# EAGLE design c64switchless (EAGLE 6.0)
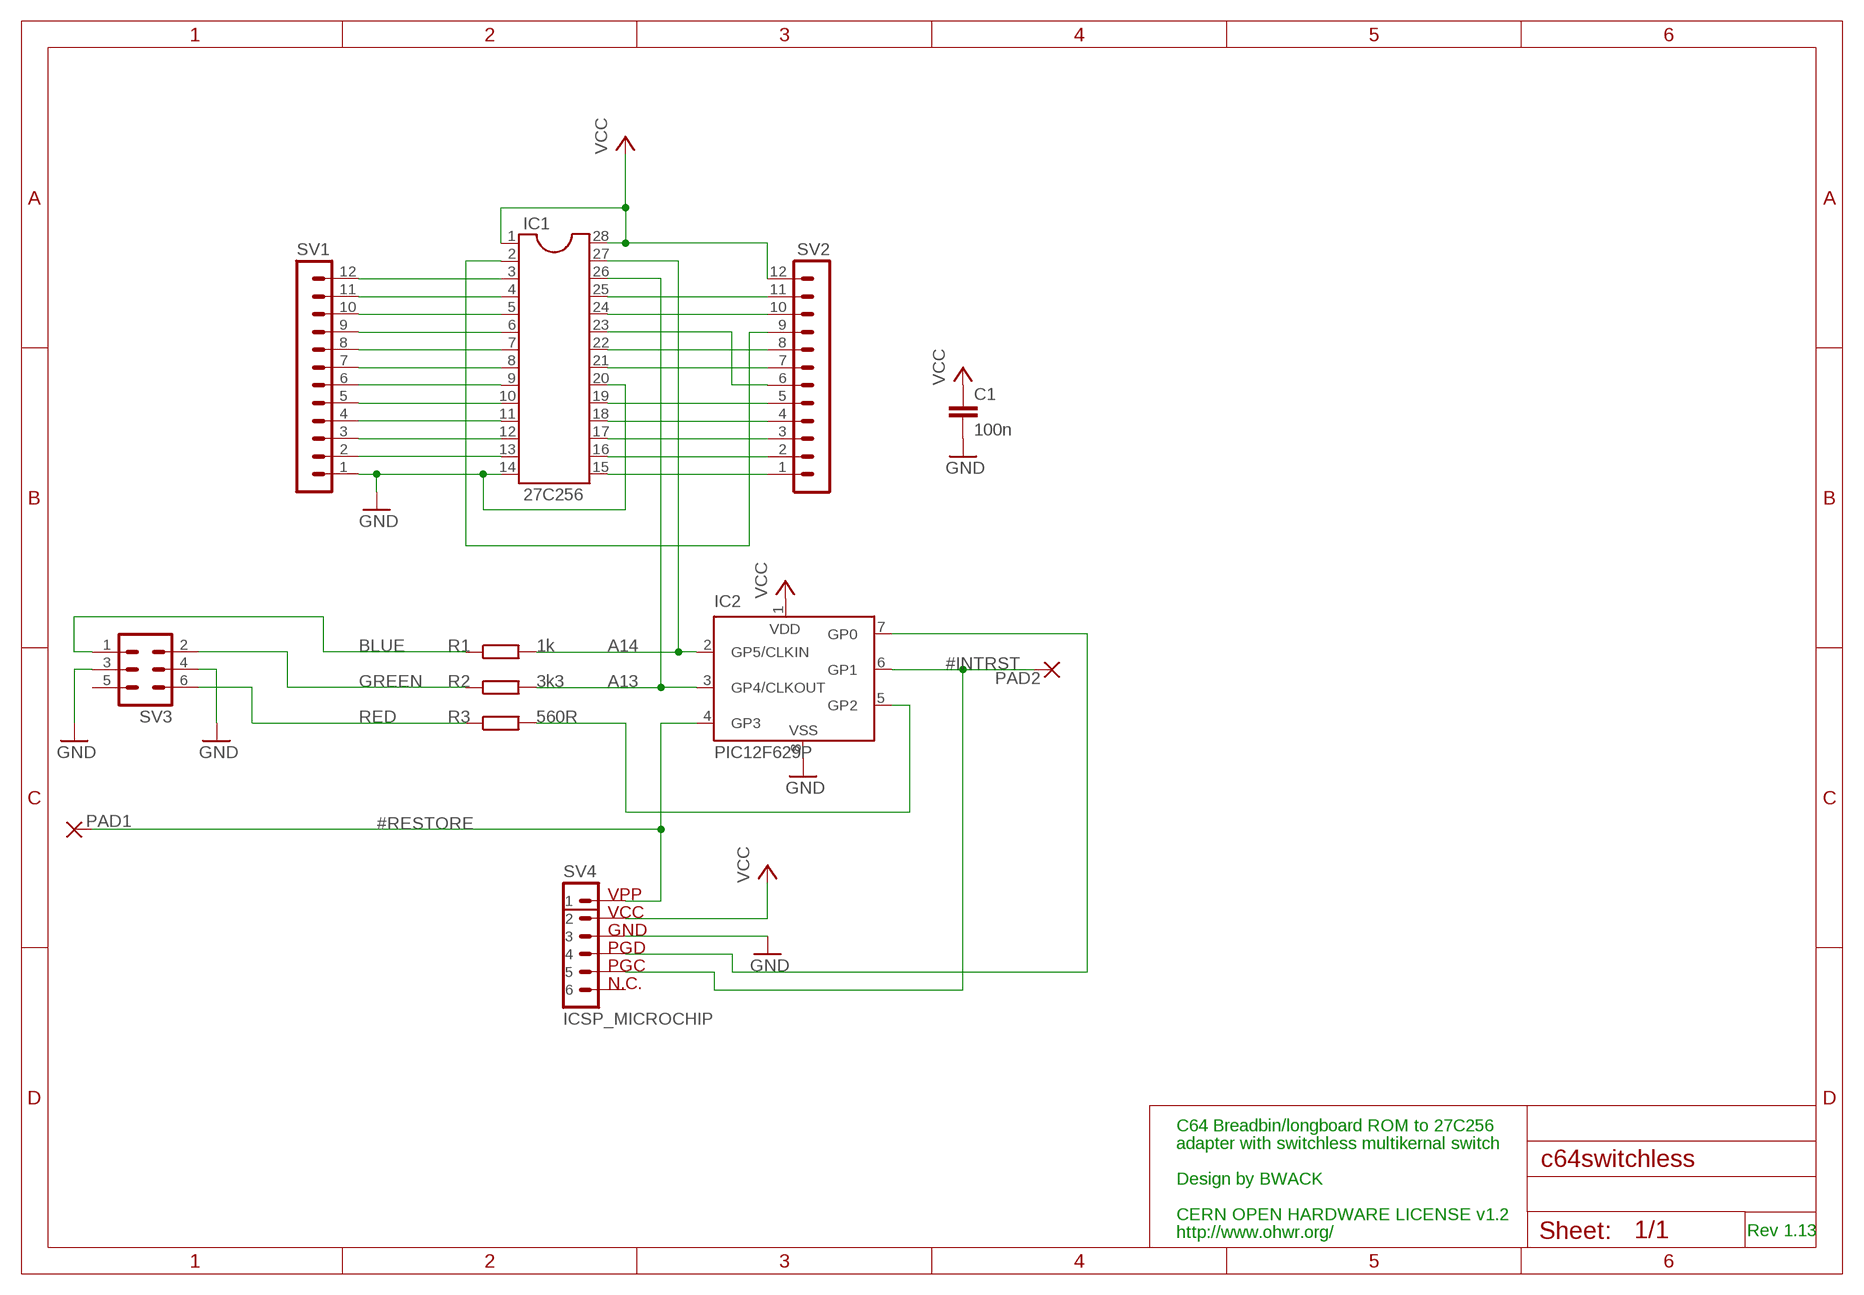
[diagram p0: schematic, sheet 1]

## Parts
C1  100n  C-EU025-024X044  [C025-024X044]
IC1  27C256  DIL28ROUND  [DIL28SPECIAL]
IC2  PIC12F629P  [DIL8]
PAD1  WIREPAD1,6/0,9  [1,6/0,9]
PAD2  WIREPAD1,6/0,9  [1,6/0,9]
R1  1k  R-EU_0207/10  [0207/10]
R2  3k3  R-EU_0207/10  [0207/10]
R3  560R  R-EU_0207/10  [0207/10]
SV1  MA12-1ROUND  [MA12-1ROUND]
SV2  MA12-1ROUND  [MA12-1ROUND]
SV3  MA03-2  [MA03-2]
SV4  ICSP_MICROCHIP  [ICSP_MICROCHIP]

## Nets
#INTRST: IC2.6(GP1) PAD2.1(P) SV4.5
#RESTORE: IC2.4(GP3) PAD1.1(P) SV4.1
A13: IC1.26 IC2.3(GP4/CLKOUT) R2.2
A14: IC1.27 IC2.2(GP5/CLKIN) R1.2
BLUE: R1.1 SV3.1
GND: C1.2 IC1.14 IC1.20 IC2.8(VSS) SV1.1 SV3.3 SV3.4 SV4.3
GREEN: R2.1 SV3.2
N$1: IC2.7(GP0) SV4.4
N$2: IC1.13 SV1.2
N$3: IC1.12 SV1.3
N$4: IC1.11 SV1.4
N$5: IC1.10 SV1.5
N$6: IC1.9 SV1.6
N$7: IC1.8 SV1.7
N$8: IC1.7 SV1.8
N$9: IC1.6 SV1.9
N$10: IC1.5 SV1.10
N$11: IC1.4 SV1.11
N$12: IC1.3 SV1.12
N$13: IC1.15 SV2.1
N$14: IC1.16 SV2.2
N$15: IC1.17 SV2.3
N$16: IC1.18 SV2.4
N$17: IC1.19 SV2.5
N$18: IC1.21 SV2.7
N$19: IC1.22 SV2.8
N$20: IC1.24 SV2.10
N$21: IC1.25 SV2.11
N$22: IC2.5(GP2) R3.2
N$23: IC1.23 SV2.6
N$24: IC1.2 SV2.9
RED: R3.1 SV3.6
VCC: C1.1 IC1.1 IC1.28 IC2.1(VDD) SV2.12 SV4.2
Unconnected: SV3.5 SV4.6

## Notes on the sheet
- C64 Breadbin/longboard ROM to 27C256
- adapter with switchless multikernal switch
- Design by BWACK
- CERN OPEN HARDWARE LICENSE v1.2
- http://www.ohwr.org/ | Rev 1.13

## Library data of the parts
C1 = rcl:C-EU: CAPACITOR, European symbol
IC1 = ic-package_edit:DIL28: Dual In Line
IC2 = microchip:PIC12F6*: Data Sheet 8-Pin FLASH-Based 8-Bit CMOS Microcontrollers Source: http://www.microchip.com .. 41190c.pdf; MF: MICROCHIP; MPN: PIC12F629-I/P; OC_FARNELL: 1292253; OC_NEWARK: 67K0822
PAD1 PAD2 = wirepad:WIREPAD: Wire PAD connect wire on PCB
R1-R3 = rcl:R-EU_: RESISTOR, European symbol
SV1 SV2 = con-lstb:MA12-1: PIN HEADER
SV3 = con-lstb:MA03-2: PIN HEADER; OC_FARNELL: unknown; OC_NEWARK: unknown
SV4 = microchip:ICSP_MICROCHIP

## Board
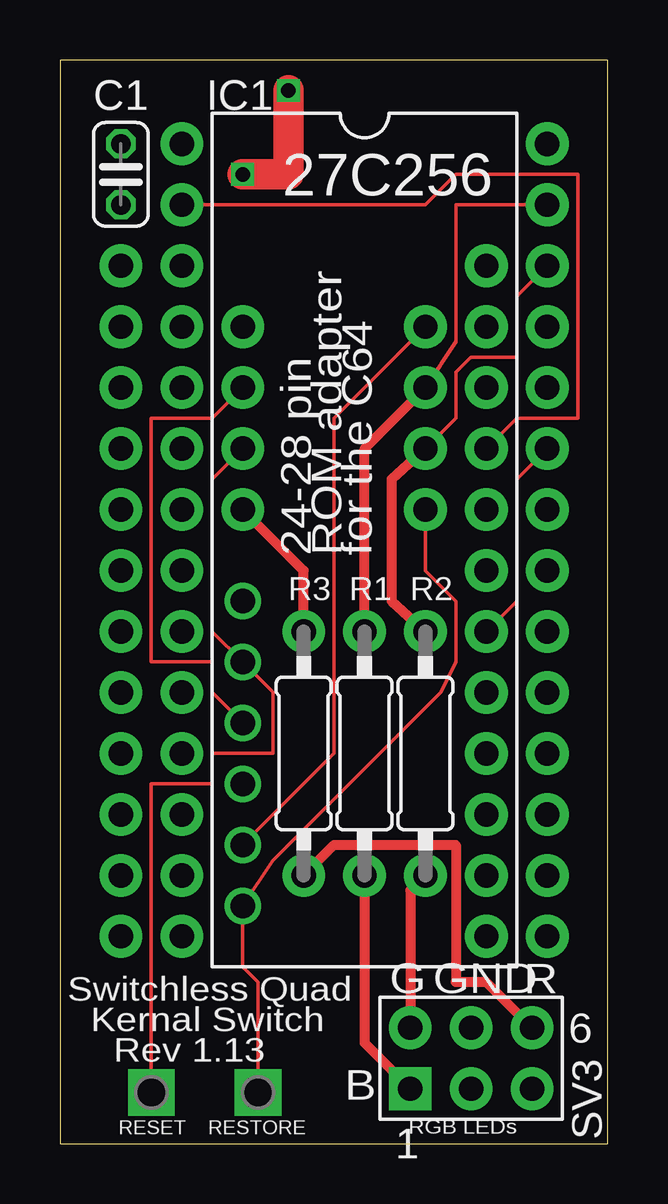
[diagram p1: board, top side]
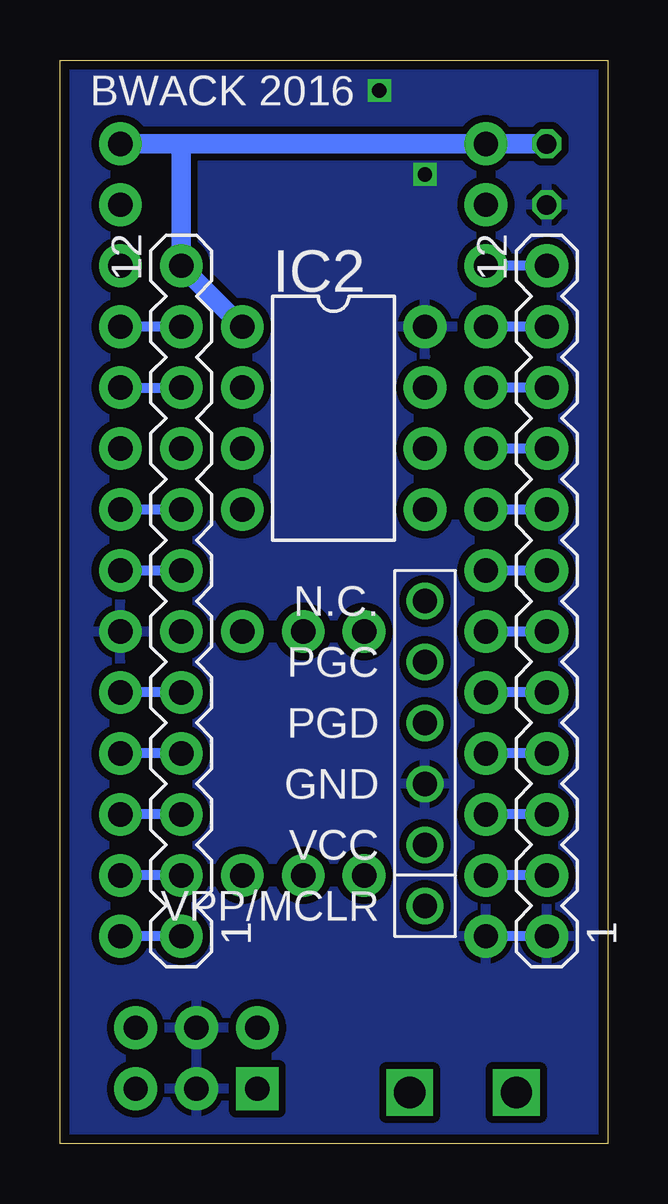
[diagram p2: board, bottom side, seen from below]

Size 22.84 x 45.14 mm. Coordinates in mm from the lower left corner, seen from the top.
Outline: 0,0 22.84,0 22.84,45.14 0,45.14 0,0
Copper layers (1*16): Top 0.0356mm / dielectric 1.5011mm / Bottom 0.0356mm
Design rules: minimum track width 6mil, minimum drill 13mil, track to track 6mil, track to pad 6mil, pad to pad 6mil, via to via 6mil, smd to smd 6mil, copper to edge 15mil, drill to drill 6mil, minimum pad ring 7mil, minimum via ring 7mil, stop-mask expansion 2.5mil, vias tented up to drill 0mil, thermal gap 10mil

### Footprints (pad centres in the part's own frame; a part is rotated, then mirrored left to right if it is on the bottom)
C025-024X044 = drill 0.813 octagon: 1 -1.27,0; 2 1.27,0
DIL28SPECIAL = drill 1.016 pad 1.778: 1 -16.51,-7.62; 2 -13.97,-7.62; 3 -11.43,-7.62; 4 -8.89,-7.62; 5 -6.35,-7.62; 6 -3.81,-7.62; 7 -1.27,-7.62; 8 1.27,-7.62; 9 3.81,-7.62; 10 6.35,-7.62; 11 8.89,-7.62; 12 11.43,-7.62; 13 13.97,-7.62; 14 16.51,-7.62; 15 16.51,7.62; 16 13.97,7.62; 17 11.43,7.62; 18 8.89,7.62; 19 6.35,7.62; 20 3.81,7.62; 21 1.27,7.62; 22 -1.27,7.62; 23 -3.81,7.62; 24 -6.35,7.62; 25 -8.89,7.62; 26 -11.43,7.62; 27 -13.97,7.62; 28 -16.51,7.62
DIL8 = drill 1.016 pad 1.778: 1 -3.81,-3.81; 2 -1.27,-3.81; 3 1.27,-3.81; 4 3.81,-3.81; 5 3.81,3.81; 6 1.27,3.81; 7 -1.27,3.81; 8 -3.81,3.81
1,6/0,9 = drill 1.3 square: 1 0,0
0207/10 = drill 1.016 pad 1.778: 1 -5.08,0; 2 5.08,0
MA12-1ROUND = drill 1.016 pad 1.778: 1 -13.97,0; 2 -11.43,0; 3 -8.89,0; 4 -6.35,0; 5 -3.81,0; 6 -1.27,0; 7 1.27,0; 8 3.81,0; 9 6.35,0; 10 8.89,0; 11 11.43,0; 12 13.97,0
MA03-2 = drill 1.016 pad 1.778 square: 1 -2.54,-1.27 | drill 1.016 pad 1.778: 2 -2.54,1.27; 3 0,-1.27; 4 0,1.27; 5 2.54,-1.27; 6 2.54,1.27
ICSP_MICROCHIP = drill 1.016: 1 0,6.35; 2 0,3.81; 3 0,1.27; 4 0,-1.27; 5 0,-3.81; 6 0,-6.35

### Placement (x,y rotation side)
C1  2.54,40.39 270 top
IC1  12.7,25.15 270 top
IC2  11.43,30.23 270 bottom
PAD1  8.26,2.13 0 top
PAD2  3.81,2.13 0 top
R1  2k  [0207/10]  12.7,16.26 90 top
R2  2k  [0207/10]  15.24,16.26 90 top
R3  2k  [0207/10]  10.16,16.26 90 top
SV1  2.54,22.61 90 bottom
SV2  17.78,22.61 90 bottom
SV3  17.14,3.56 0 top
SV4  7.62,16.26 180 bottom

### Tracks (layer width: path | path; a pad name or v marks a point on that pad's centre or on a via)
#INTRST
  Top 0.152: PAD2.1 3.81,14.99 6.35,14.99 6.35,16.26 8.89,16.26 8.89,18.8 SV4.5 6.35,21.34 6.35,27.69 IC2.6
#RESTORE
  Top 0.152: IC2.4 15.24,23.88 16.51,22.61 16.51,20.07 15.88,18.8 8.89,11.81 SV4.1 7.62,7.37 8.26,6.73 PAD1.1
A13
  Top 0.152: IC1.26 19.05,35.31 19.05,32.77 17.14,32.77 16.51,32.13 16.51,30.23 IC2.3
  Top 0.406: R2.2 13.84,22.61 13.84,27.69 IC2.3
A14
  Top 0.152: IC1.27 16.51,39.12 16.51,33.4 IC2.2
  Top 0.406: R1.2 12.7,28.96 IC2.2
BLUE
  Top 0.406: R1.1 12.7,4.19 SV3.1
GND  (via drill 0.6)
  Top 1.27: v9.53,43.88 9.53,40.39 v7.62,40.39
  Bottom 0.406: SV1.1 IC1.14
  pour Bottom (isolate 0.305): 0,45.47 22.86,45.47 22.86,0 0,0
GREEN
  Top 0.406: R2.1 14.61,10.54 SV3.2
N$1
  Top 0.152: IC2.7 6.35,30.23 3.81,30.23 3.81,20.07 6.35,20.07 6.35,18.8 SV4.4
N$2
  Bottom 0.406: SV1.2 IC1.13
N$3
  Bottom 0.406: SV1.3 IC1.12
N$4
  Bottom 0.406: SV1.4 IC1.11
N$5
  Bottom 0.406: SV1.5 IC1.10
N$6
  Bottom 0.406: SV1.6 IC1.9
N$7
  Bottom 0.406: SV1.7 IC1.8
N$8
  Bottom 0.406: SV1.8 IC1.7
N$9
  Bottom 0.406: SV1.9 IC1.6
N$10
  Bottom 0.406: SV1.10 IC1.5
N$11
  Bottom 0.406: SV1.11 IC1.4
N$12
  Bottom 0.406: SV1.12 IC1.3
N$13
  Bottom 0.406: SV2.1 IC1.15
N$14
  Bottom 0.406: SV2.2 IC1.16
N$15
  Bottom 0.406: SV2.3 IC1.17
N$16
  Bottom 0.406: SV2.4 IC1.18
N$17
  Bottom 0.406: SV2.5 IC1.19
N$18
  Bottom 0.406: SV2.7 IC1.21
N$19
  Bottom 0.406: SV2.8 IC1.22
N$20
  Bottom 0.406: IC1.24 SV2.10
N$21
  Bottom 0.406: SV2.11 IC1.25
N$22
  Top 0.406: R3.2 10.16,23.88 IC2.5
N$23
  Top 0.152: IC1.23 19.05,27.69 19.05,22.61 SV2.6
N$24
  Top 0.152: IC1.2 15.24,39.12 16.51,40.39 21.59,40.39 21.59,30.23 19.05,30.23 SV2.9
RED
  Top 0.406: R3.1 11.43,12.45 16.51,12.45 16.51,6.73 17.78,6.73 SV3.6
VCC
  Top 0.152: SV4.2 11.43,16.26 11.43,18.8 11.43,30.23 IC2.1
  Bottom 0.813: C1.1 IC1.1 17.78,41.66 | 17.78,41.66 SV2.12 IC2.1 | 17.78,41.66 IC1.28

### Text on the board
tPlace: 24-28 pin | ROM adapter | for the C64 | Switchless Quad | G | GND | R | Kernal Switch | Rev 1.13 | B | RGB LEDs | RESET | RESTORE
bPlace: BWACK 2016